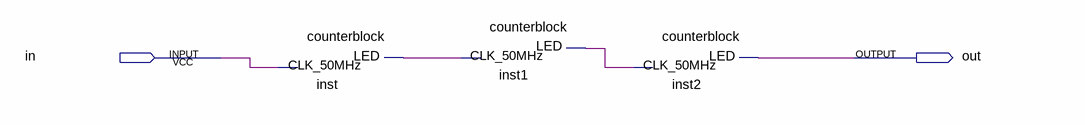
[diagram p0: schematic sheet]
// Quartus schematic counterX3.bdf as structural Verilog: 3 symbols, 2 pins
module counterX3 (
  input  in,
  output out
);

  wire inst1_led, inst_led;

  counterblock inst (.CLK_50MHz(in), .LED(inst_led));
  counterblock inst1 (.CLK_50MHz(inst_led), .LED(inst1_led));
  counterblock inst2 (.CLK_50MHz(inst1_led), .LED(out));
endmodule
